# EAGLE schematic IoT (EAGLE 9.1.0)
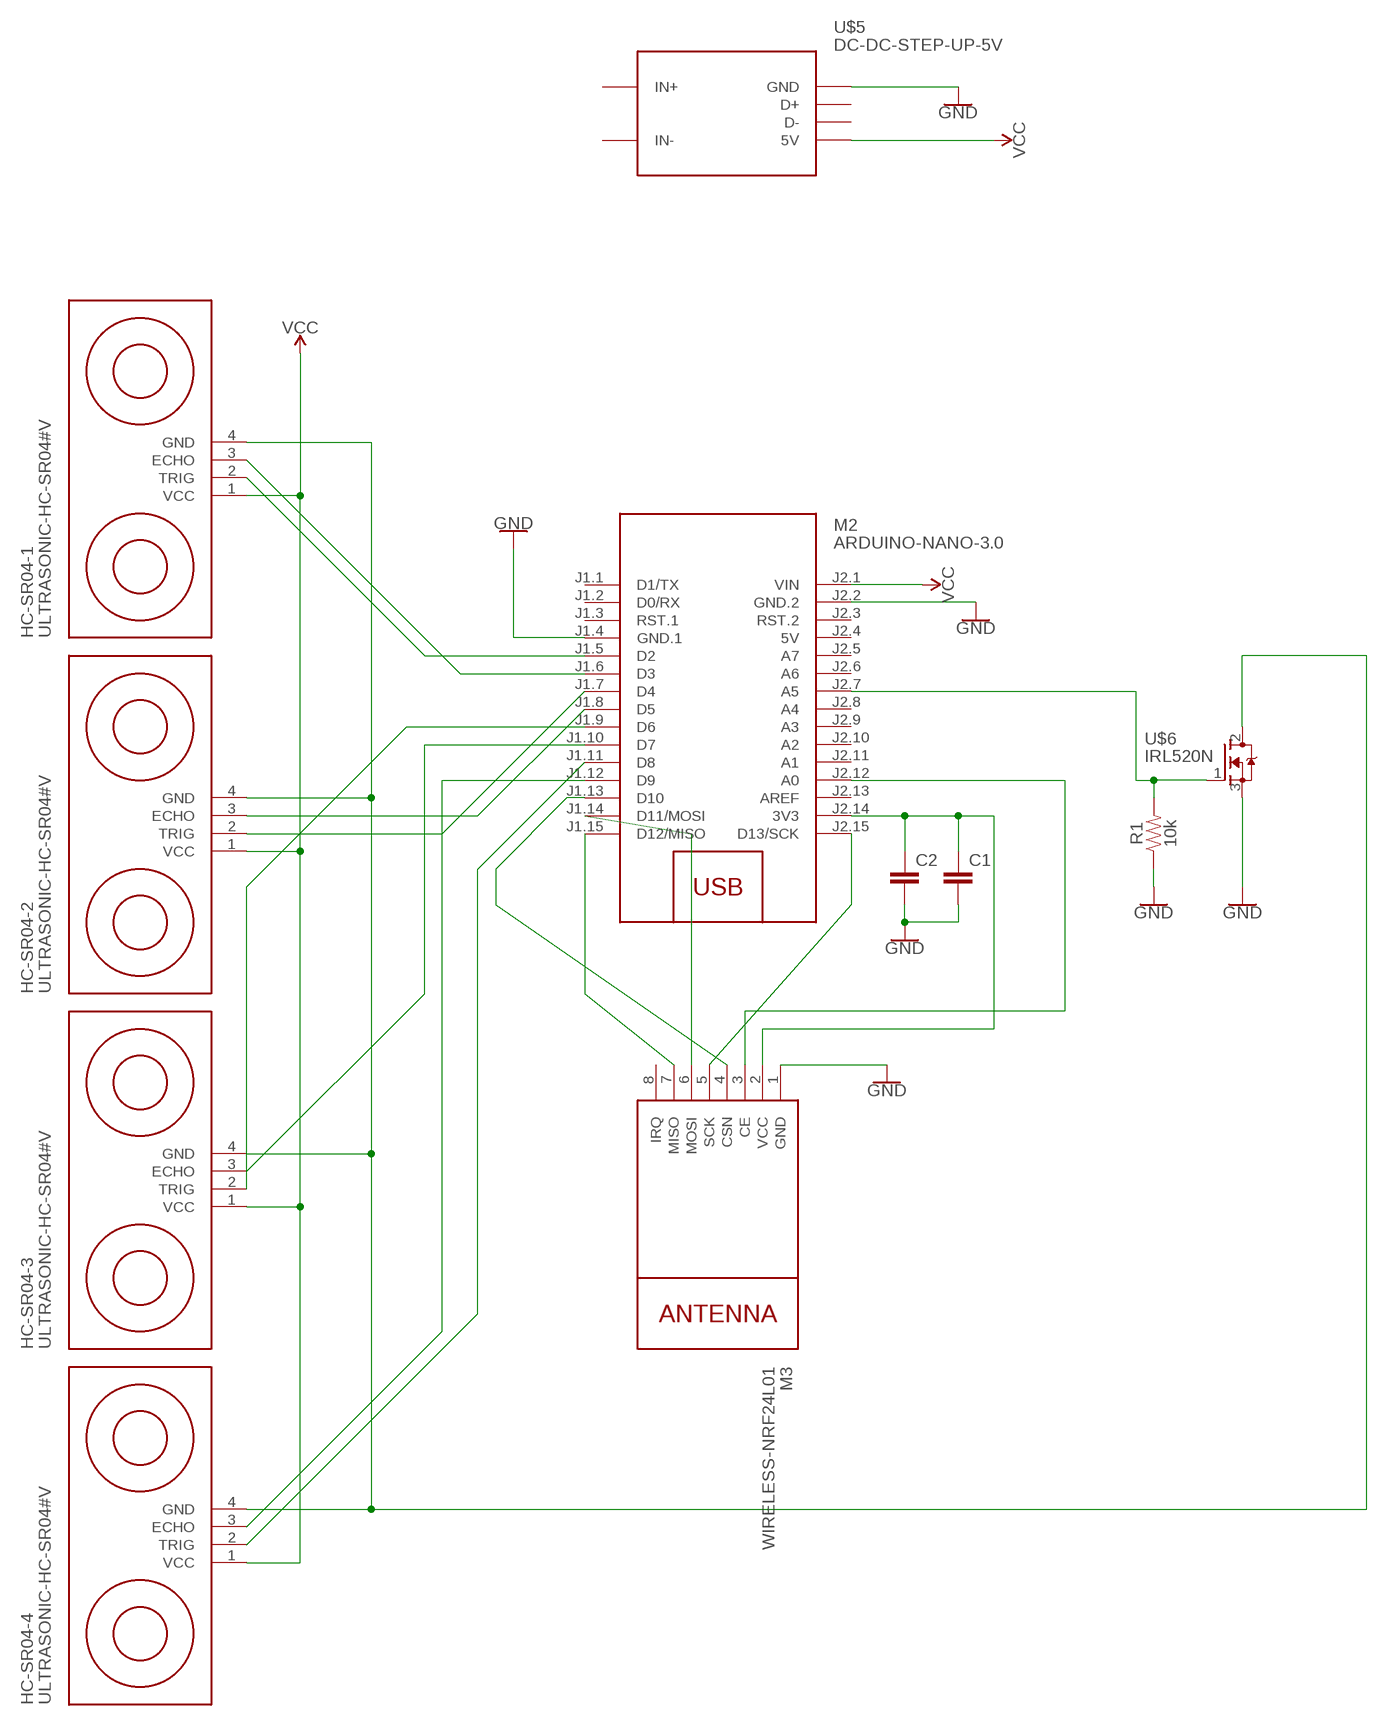
[diagram p0: schematic, sheet 1]

## Parts
C1  C-EU025-040X050  [C025-040X050]
C2  C-EU025-040X050  [C025-040X050]
HC-SR04-1  ULTRASONIC-HC-SR04#V  [ULTRASONIC-HC-SR04#V]
HC-SR04-2  ULTRASONIC-HC-SR04#V  [ULTRASONIC-HC-SR04#V]
HC-SR04-3  ULTRASONIC-HC-SR04#V  [ULTRASONIC-HC-SR04#V]
HC-SR04-4  ULTRASONIC-HC-SR04#V  [ULTRASONIC-HC-SR04#V]
M2  ARDUINO-NANO-3.0  [ARDUINO-NANO-3.0]
M3  WIRELESS-NRF24L01  [WIRELESS-NRF24L01]
R1  10k  10KOHM-HORIZ_KIT-1/4W-1%  [AXIAL-0.3-KIT]
U$5  DC-DC-STEP-UP-5V  [DC-DC-STEP-UP-5V]
U$6  IRL520N  [TO220-VERT]

## Nets
GND: C1.2 C2.2 M2.J1.4(GND.1) M2.J2.2(GND.2) M3.1(GND) R1.P$1 U$5.GND U$6.3(S)
N$1: M2.J2.7(A5) R1.P$2 U$6.1(G)
N$4: C1.1 C2.1 M2.J2.14(3V3) M3.2(VCC)
N$5: HC-SR04-1.2(TRIG) M2.J1.5(D2)
N$6: HC-SR04-1.3(ECHO) M2.J1.6(D3)
N$7: HC-SR04-2.3(ECHO) M2.J1.8(D5)
N$8: HC-SR04-2.2(TRIG) M2.J1.7(D4)
N$9: HC-SR04-1.4(GND) HC-SR04-2.4(GND) HC-SR04-3.4(GND) HC-SR04-4.4(GND) U$6.2(D)
N$10: HC-SR04-3.3(ECHO) M2.J1.10(D7)
N$11: HC-SR04-3.2(TRIG) M2.J1.9(D6)
N$12: HC-SR04-4.3(ECHO) M2.J1.12(D9)
N$13: HC-SR04-4.2(TRIG) M2.J1.11(D8)
N$14: M2.J2.12(A0) M3.3(CE)
N$15: M2.J1.13(D10) M3.4(CSN)
N$16: M2.J2.15(D13/SCK) M3.5(SCK)
N$17: M2.J1.14(D11/MOSI) M3.6(MOSI)
N$18: M2.J1.15(D12/MISO) M3.7(MISO)
VCC: HC-SR04-1.1(VCC) HC-SR04-2.1(VCC) HC-SR04-3.1(VCC) HC-SR04-4.1(VCC) M2.J2.1(VIN) U$5.5V
Unconnected: M2.J1.1(D1/TX) M2.J1.2(D0/RX) M2.J1.3(RST.1) M2.J2.3(RST.2) M2.J2.5(A7) M2.J2.6(A6) M2.J2.8(A4) M2.J2.9(A3) M2.J2.10(A2) M2.J2.11(A1) M2.J2.13(AREF) M3.8(IRQ) U$5.D+ U$5.D-

## Power pins joined to a net without a drawn wire
5V: M2.J2.4(5V)
IN+: U$5.IN+
IN-: U$5.IN-

## Library data of the parts
C1 C2 = resistor:C-EU: CAPACITOR, European symbol
HC-SR04-1-HC-SR04-4 = diy-modules:ULTRASONIC-HC-SR04: Ultrasonic Ranging Module HC-SR04 More details available here: http://randomnerdtutorials.com/complete-guide-for-ultrasonic-sensor-hc-sr04/ Click here to find device on ebay.com <http://www.ebay.com/sch/hc+sr04+ultrasonic>
M2 = diy-modules:ARDUINO-NANO-3.0: Arduino Nano 3.0 and compatible devices More details available here: https://www.arduino.cc/en/Main/ArduinoBoardNano Click here to find device on ebay.com <http://www.ebay.com/sch/arduino+nano>
M3 = diy-modules:WIRELESS-NRF24L01: 2.4 GHz Wireless Module based on NRF24L01 chip More details available here: http://www.electrodragon.com/w/NRF24L01 Click here to find device on ebay.com <http://www.ebay.com/sch/nrf24l01+arduino>
R1 = SparkFun-Resistors:10KOHM: 10kΩ resistor A resistor is a passive two-terminal electrical component that implements electrical resistance as a circuit element. Resistors act to reduce current flow, and, at the same time, act to lower voltage levels within circuits. - Wikipedia; PROD_ID: RES-12183
U$5 = diy-modules:DC-DC-STEP-UP-5V: DC/DC Step-Up Converter
U$6 = IRL520N:IRL520N: IRL520N; AVAILABILITY: Unavailable; DESCRIPTION: 100V Single N-Channel HEXFET Power MOSFET in a TO-220AB package; MF: International Rectifier; MP: IRL520N; PACKAGE: None; PRICE: 1.03 USD